# Altium schematic sheet ASB.SchDoc (part 2 of 3)
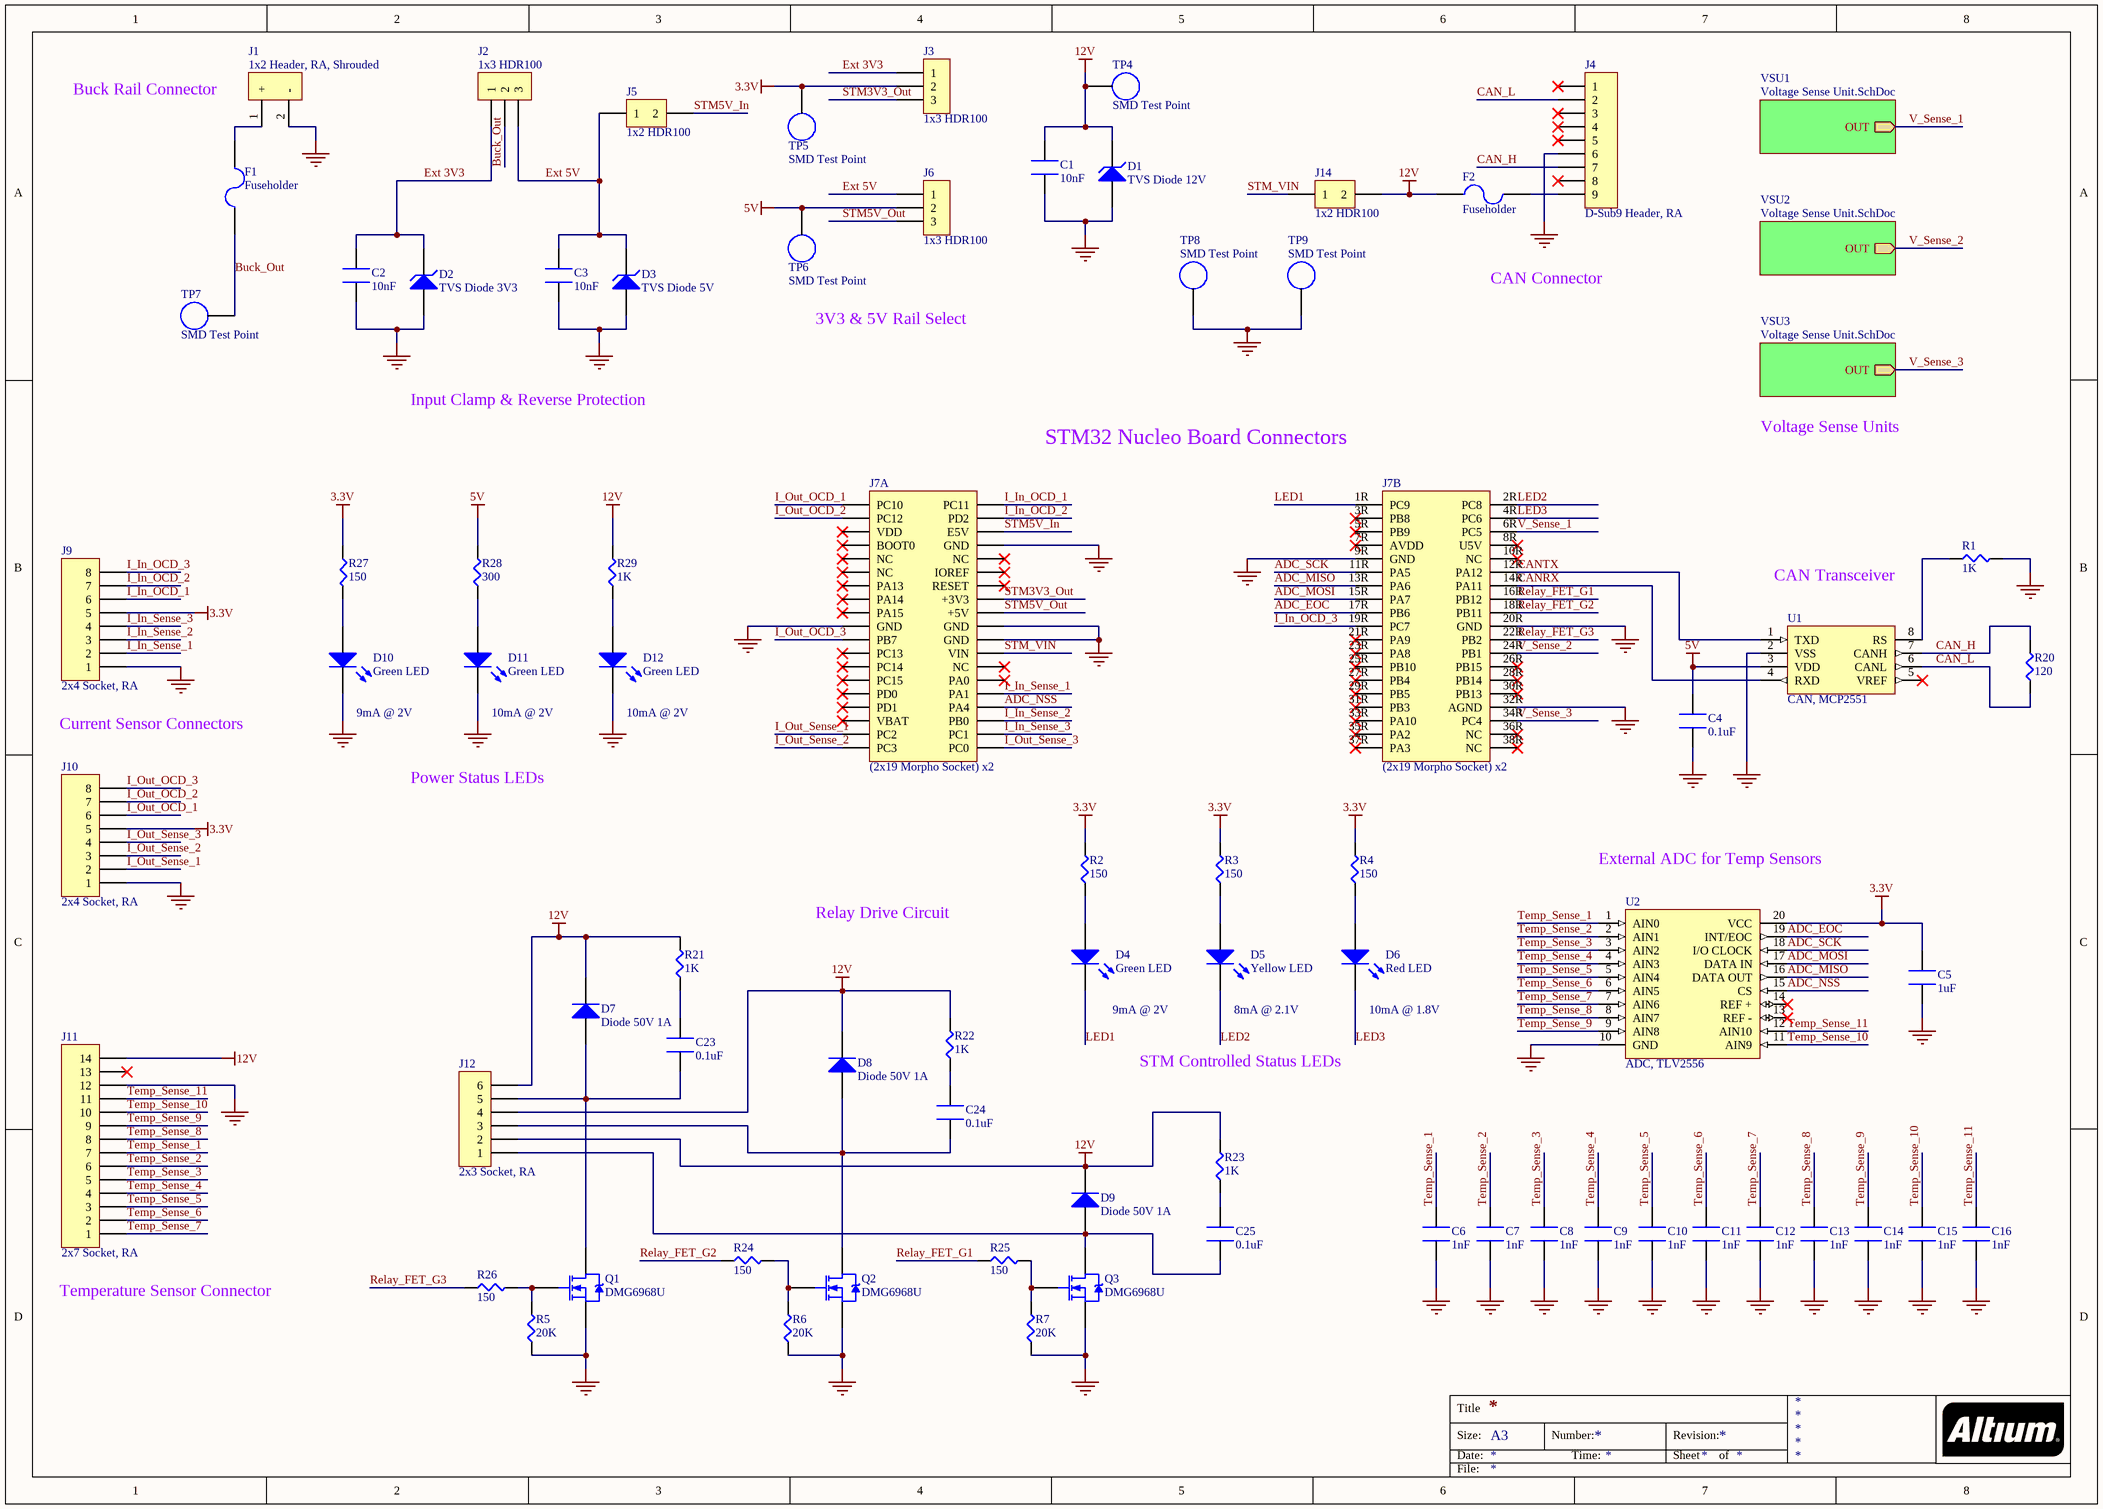
[diagram p1: ASB.SchDoc]
## Library data of the parts
C1-C3 = CL21B103KBANNNC: Cap Ceramic 0.01uF 50V X7R 10% SMD 0805 125C Paper T/R; Manufacturer: Samsung; Supplier 1: Digi-Key; Supplier Part Number 1: 1276-1015-1-ND; Manufacturer Part Number: CL21B103KBANNNC; Stock 1: 5594647; Pricing 1: 1 = 0.10000, 10 = 0.04100, 100 = 0.01830, 500 = 0.01310, 1000 = 0.01030 (USD); RoHS: Yes; Mount: Surface Mount; Case/Package: 0805; Case Code (Metric): 2012; Case Code (Imperial): 0805; Material: Ceramic; Contact Plating: Tin; Min Operating Temperature: -55°C; Max Operating Temperature: 125°C; Capacitance: 10nF; Tolerance: 10%; Packaging: Tape and Reel; Voltage Rating: 50V; Dielectric: X7R; Voltage: 50V; Voltage Rating (DC): 50V; Length: 2mm; Height: 0.65mm; Width: 0.049inch; Thickness: 0.03inch; Depth: 1.25mm; Radiation Hardening: No; Lead Free: Lead Free; ComponentLink1URL: https://datasheet.ciiva.com/25709/cl21b103kbannnc-25709781.pdf?src-supplier=Digi-Key; ComponentLink1Description: https://datasheet.ciiva.com/25709/cl21b103kbannnc-25709781.pdf?src-supplier=Digi-Key; ComponentLink2URL: https://datasheet.ciiva.com/26838/getdatasheetpartid-358359-26838647.pdf?src-supplier=Verical; ComponentLink2Description: https://datasheet.ciiva.com/26838/getdatasheetpartid-358359-26838647.pdf?src-supplier=Verical; ComponentLink3URL: https://datasheet.ciiva.com/29199/455082-da-01-en-vs-kondensator-0805-29199459.pdf?src-supplier=Conrad; ComponentLink3Description: https://datasheet.ciiva.com/29199/455082-da-01-en-vs-kondensator-0805-29199459.pdf?src-supplier=Conrad; ComponentLink4URL: https://datasheet.ciiva.com/16199/cl05b104kq5nnnc-16199304.pdf?src-supplier=Future+Electronics; ComponentLink4Description: https://datasheet.ciiva.com/16199/cl05b104kq5nnnc-16199304.pdf?src-supplier=Future+Electronics; ComponentLink5URL: https://datasheet.ciiva.com/26310/mlcc-catalogdownload2013-eng-26310223.pdf?src-supplier=Distrelec; ComponentLink5Description: https://datasheet.ciiva.com/26310/mlcc-catalogdownload2013-eng-26310223.pdf?src-supplier=Distrelec; Category: Capacitors
C4 C23-C25 = CL21B104KBCWPNC: CAP CER 0.1UF 50V X7R 0805; Manufacturer: Samsung; Capacitance: 100nF; Tolerance: 10%; Supplier 1: Digi-Key; Supplier Part Number 1: 1276-6557-1-ND; Manufacturer Part Number: CL21B104KBCWPNC; Stock 1: 6545; Pricing 1: 1 = 0.10000, 10 = 0.06700, 100 = 0.02990, 500 = 0.02138, 1000 = 0.01680 (USD); RoHS: Yes; Mount: Surface Mount; Case/Package: 0805; Case Code (Metric): 2012; Case Code (Imperial): 0805; Min Operating Temperature: -55°C; Max Operating Temperature: 125°C; Packaging: Tape and Reel; Voltage Rating: 50V; Features: Soft Termination; Length: 0.079inch; Width: 0.049inch; Thickness: 0.053inch; Ratings: AEC-Q200; Category: Capacitors
C5 = CL21B105KAFNNNE: Cap Ceramic 1uF 25V X7R 10% SMD 0805 125C T/R; Manufacturer: Samsung; Supplier 1: Digi-Key; Supplier Part Number 1: 1276-1066-1-ND; Manufacturer Part Number: CL21B105KAFNNNE; Stock 1: 1606570; Pricing 1: 1 = 0.10000, 10 = 0.07600, 100 = 0.03380, 500 = 0.02416, 1000 = 0.01898 (USD); RoHS: Yes; Mount: Surface Mount; Case/Package: 0805; Contact Plating: Tin; Case Code (Metric): 2012; Case Code (Imperial): 0805; Min Operating Temperature: -55°C; Max Operating Temperature: 125°C; Packaging: Tape and Reel; Package Quantity: 1; Capacitance: 1uF; Tolerance: 10%; Voltage Rating: 25V; Dielectric: X7R; Voltage: 25V; Voltage Rating (DC): 25V; Length: 2mm; Height: 1.25mm; Depth: 1.25mm; Width: 0.049inch; Thickness: 0.053inch; Radiation Hardening: No; Lead Free: Lead Free; ComponentLink1URL: https://datasheet.ciiva.com/25800/cl21b105kafnnne-25800163.pdf?src-supplier=Digi-Key; ComponentLink1Description: https://datasheet.ciiva.com/25800/cl21b105kafnnne-25800163.pdf?src-supplier=Digi-Key; ComponentLink2URL: https://datasheet.ciiva.com/15195/getdatasheetpartid-355205-15195880.pdf?src-supplier=Verical; ComponentLink2Description: https://datasheet.ciiva.com/15195/getdatasheetpartid-355205-15195880.pdf?src-supplier=Verical; Category: Capacitors
C6-C16 = C0805C102J5HACAUTO: CAP CER 0805 1NF 50V ULTRA STABL; Manufacturer: KEMET; Supplier 1: Digi-Key; Supplier Part Number 1: 399-16591-1-ND; Manufacturer Part Number: C0805C102J5HACAUTO; Stock 1: 1854; Pricing 1: 1 = 0.21000, 10 = 0.15100, 100 = 0.07080, 500 = 0.04964, 1000 = 0.04109 (USD); RoHS: No; ComponentLink1URL: https://api.kemet.com/component-edge/download/datasheet/C0805C102J5HACAUTO.pdf?src-supplier=Digi-Key; ComponentLink1Description: https://api.kemet.com/component-edge/download/datasheet/C0805C102J5HACAUTO.pdf?src-supplier=Digi-Key; Category: Capacitors
D1 = SD12T1G: TVS DIODE 12V 19V SOD323; Manufacturer: ON Semiconductor; Number of Elements: 1; Capacitance: 150pF; Reverse Breakdown Voltage: 13.3V; Max Surge Current: 15A; Direction: Unidirectional; Clamping Voltage: 25V; Peak Pulse Power: 350W; Power Line Protection: No; ESD Protection: Yes; Max Reverse Leakage Current: 1uA; Test Current: 1mA; Max Breakdown Voltage: 15.75V; Element Configuration: Single; Supplier 1: Digi-Key; Supplier Part Number 1: SD12T1GOSCT-ND; Manufacturer Part Number: SD12T1G; Stock 1: 159232; Pricing 1: 1 = 0.47000, 10 = 0.34900, 100 = 0.19740, 500 = 0.13076, 1000 = 0.10025 (USD); RoHS: Yes; Case/Package: SOD-323-2; Number of Pins: 2; Contact Plating: Tin; Min Operating Temperature: -55°C; Max Operating Temperature: 150°C; Package Quantity: 1; Operating Supply Voltage: 12V; Packaging: Tape and Reel; Number of Unidirectional Channels: 1; Reverse Standoff Voltage: 12V; Min Breakdown Voltage: 13.3V; Breakdown Voltage: 13.3V; Number of Channels: 1; Polarity: Unidirectional; Termination: SMD/SMT; Working Voltage: 12V; Leakage Current: 1uA; Peak Pulse Current: 15A; Power Dissipation: 350W; Voltage Rating (DC): 12V; Composition: Zener; Length: 1.7mm; Height: 1mm; Width: 1.35mm; Depth: 1.25mm; Radiation Hardening: No; Lead Free: Lead Free; ComponentLink1URL: https://datasheet.ciiva.com/11193/sd05t1-d-11193474.pdf?src-supplier=Avnet; ComponentLink1Description: https://datasheet.ciiva.com/11193/sd05t1-d-11193474.pdf?src-supplier=Avnet; ComponentLink2URL: https://datasheet.ciiva.com/15143/getdatasheetpartid-52921-15143109.pdf?src-supplier=Verical; ComponentLink2Description: https://datasheet.ciiva.com/15143/getdatasheetpartid-52921-15143109.pdf?src-supplier=Verical; ComponentLink3URL: https://datasheet.ciiva.com/30479/0900766b81250bd7-30479026.pdf?src-supplier=RSComponents; ComponentLink3Description: https://datasheet.ciiva.com/30479/0900766b81250bd7-30479026.pdf?src-supplier=RSComponents; ComponentLink4URL: https://datasheet.ciiva.com/339/sd05t1-d-339833.pdf?src-supplier=Digi-Key; ComponentLink4Description: https://datasheet.ciiva.com/339/sd05t1-d-339833.pdf?src-supplier=Digi-Key; ComponentLink5URL: https://datasheet.ciiva.com/11193/sd05t1-d-11193470.pdf?src-supplier=Avnet; ComponentLink5Description: https://datasheet.ciiva.com/11193/sd05t1-d-11193470.pdf?src-supplier=Avnet; ComponentLink6URL: https://datasheet.ciiva.com/339/sd05t1-d-339832.pdf?src-supplier=Digi-Key; ComponentLink6Description: https://datasheet.ciiva.com/339/sd05t1-d-339832.pdf?src-supplier=Digi-Key; ComponentLink7URL: https://datasheet.ciiva.com/339/sd05t1-d-339834.pdf?src-supplier=Digi-Key; ComponentLink7Description: https://datasheet.ciiva.com/339/sd05t1-d-339834.pdf?src-supplier=Digi-Key; Category: Circuit Protection
D2 = CDSOD323-T03S: ESD Suppressor TVS ±30kV 2-Pin SOD-323 T/R; Manufacturer: Bourns; Direction: Unidirectional; Operating Supply Voltage: 3.3V; Max Surge Current: 43A; Capacitance: 500pF; Number of Unidirectional Channels: 1; Min Breakdown Voltage: 4V; Clamping Voltage: 10.9V; Peak Pulse Power: 500W; Power Line Protection: No; Leakage Current: 125uA; Element Configuration: Single; Supplier 1: Digi-Key; Supplier Part Number 1: CDSOD323-T03SCT-ND; Manufacturer Part Number: CDSOD323-T03S; Stock 1: 99362; Pricing 1: 1 = 0.72000, 10 = 0.60600, 25 = 0.53000, 100 = 0.45420, 250 = 0.39368, 500 = 0.33310, 1000 = 0.25740 (USD); RoHS: Yes; Mount: Surface Mount; Case/Package: SOD-323-2; Number of Pins: 2; Contact Plating: Tin; Min Operating Temperature: -55°C; Max Operating Temperature: 150°C; Packaging: Tape and Reel; Package Quantity: 3000; Reverse Standoff Voltage: 3.3V; Polarity: Unidirectional; Number of Channels: 1; Breakdown Voltage: 4V; Termination: SMD/SMT; Working Voltage: 3.3V; Max Power Dissipation: 500W; Peak Pulse Current: 43A; Composition: Zener; Length: 1.9mm; Depth: 1.45mm; Radiation Hardening: No; REACH SVHC: No SVHC; ComponentLink1URL: https://datasheet.ciiva.com/22685/1671000-22685541.pdf?src-supplier=Element14; ComponentLink1Description: https://datasheet.ciiva.com/22685/1671000-22685541.pdf?src-supplier=Element14; ComponentLink2URL: https://datasheet.ciiva.com/6575/cdsod323-txxsc-6575941.pdf?src-supplier=Digi-Key; ComponentLink2Description: https://datasheet.ciiva.com/6575/cdsod323-txxsc-6575941.pdf?src-supplier=Digi-Key; ComponentLink3URL: https://datasheet.ciiva.com/11193/cdsod323-txxsc-11193742.pdf?src-supplier=Avnet; ComponentLink3Description: https://datasheet.ciiva.com/11193/cdsod323-txxsc-11193742.pdf?src-supplier=Avnet; Category: Circuit Protection
D3 = SD05T1G: TVS DIODE 5V 9.8V SOD323; Manufacturer: ON Semiconductor; Capacitance: 350pF; Direction: Unidirectional; Clamping Voltage: 14.5V; Peak Pulse Power: 350W; Number of Unidirectional Channels: 1; Min Breakdown Voltage: 6.2V; Power Line Protection: No; Peak Pulse Current: 24A; Element Configuration: Single; Breakdown Voltage: 6.75V; Leakage Current: 10uA; Max Breakdown Voltage: 7.3V; Test Current: 1mA; ESD Protection: Yes; Max Power Dissipation: 200mW; Supplier 1: Digi-Key; Supplier Part Number 1: SD05T1GOSCT-ND; Manufacturer Part Number: SD05T1G; Stock 1: 61559; Pricing 1: 1 = 0.49000, 10 = 0.36500, 100 = 0.20680, 500 = 0.13698, 1000 = 0.10502 (USD); RoHS: Yes; Case/Package: SOD-323-2; Number of Pins: 2; Contact Plating: Tin; Min Operating Temperature: -55°C; Max Operating Temperature: 150°C; Packaging: Tape and Reel; Reverse Standoff Voltage: 5V; Working Voltage: 5V; Composition: Zener; Package Quantity: 1; Operating Supply Voltage: 5V; Max Surge Current: 24A; Number of Elements: 1; Reverse Breakdown Voltage: 6.2V; Polarity: Unidirectional; Termination: SMD/SMT; Power Dissipation: 350W; Max Reverse Leakage Current: 10uA; Voltage Rating (DC): 5V; Max Output Current: 24A; Length: 1.7mm; Height: 1mm; Width: 1.35mm; Depth: 1.25mm; Radiation Hardening: No; Lead Free: Lead Free; REACH SVHC: No SVHC; ComponentLink1URL: https://datasheet.ciiva.com/4507/sd05t1-d-241634-4507873.pdf?src-supplier=Mouser; ComponentLink1Description: https://datasheet.ciiva.com/4507/sd05t1-d-241634-4507873.pdf?src-supplier=Mouser; ComponentLink2URL: https://datasheet.ciiva.com/16200/sd05t1-d-16200994.pdf?src-supplier=Future+Electronics; ComponentLink2Description: https://datasheet.ciiva.com/16200/sd05t1-d-16200994.pdf?src-supplier=Future+Electronics; ComponentLink3URL: https://datasheet.ciiva.com/15143/getdatasheetpartid-117154-15143559.pdf?src-supplier=Verical; ComponentLink3Description: https://datasheet.ciiva.com/15143/getdatasheetpartid-117154-15143559.pdf?src-supplier=Verical; ComponentLink4URL: https://datasheet.ciiva.com/30478/0900766b81250bd7-30478714.pdf?src-supplier=RSComponents; ComponentLink4Description: https://datasheet.ciiva.com/30478/0900766b81250bd7-30478714.pdf?src-supplier=RSComponents; ComponentLink5URL: https://datasheet.ciiva.com/339/sd05t1-d-339830.pdf?src-supplier=Digi-Key; ComponentLink5Description: https://datasheet.ciiva.com/339/sd05t1-d-339830.pdf?src-supplier=Digi-Key; ComponentLink6URL: https://datasheet.ciiva.com/339/sd05t1-d-339831.pdf?src-supplier=Digi-Key; ComponentLink6Description: https://datasheet.ciiva.com/339/sd05t1-d-339831.pdf?src-supplier=Digi-Key; ComponentLink7URL: https://datasheet.ciiva.com/11193/sd05t1-d-11193467.pdf?src-supplier=Avnet; ComponentLink7Description: https://datasheet.ciiva.com/11193/sd05t1-d-11193467.pdf?src-supplier=Avnet; ComponentLink8URL: https://datasheet.ciiva.com/22637/1878253-22637228.pdf?src-supplier=Element14; ComponentLink8Description: https://datasheet.ciiva.com/22637/1878253-22637228.pdf?src-supplier=Element14; ComponentLink9URL: https://datasheet.ciiva.com/25956/sd05t1-d-25956638.pdf?src-supplier=Avnet+Europe; ComponentLink9Description: https://datasheet.ciiva.com/25956/sd05t1-d-25956638.pdf?src-supplier=Avnet+Europe; Category: Circuit Protection
D4 D10-D12 = SML-LXT0805GW-TR: LED GREEN DIFFUSED SMD; Manufacturer: Lumex; Lens Color: White; Viewing Angle: 140°; Lens Style: Rectangular; Luminous Intensity: 11mcd; Forward Voltage: 2V; Wavelength: 565nm; Forward Current: 20mA; Power Rating: 50mW; Dominant Wavelength: 568nm; Number of LEDs: 1; Approvals: UL; Supplier 1: Digi-Key; Supplier Part Number 1: 67-1553-1-ND; Manufacturer Part Number: SML-LXT0805GW-TR; Stock 1: 417501; Pricing 1: 1 = 0.41000, 10 = 0.29000, 25 = 0.25160, 100 = 0.19360, 250 = 0.15732, 500 = 0.11616, 1000 = 0.09680 (USD); RoHS: Yes; Mount: Surface Mount; Case/Package: 0805; Number of Pins: 2; Color: Green; Case Code (Metric): 2012; Case Code (Imperial): 0805; Min Operating Temperature: -25°C; Max Operating Temperature: 85°C; Package Quantity: 1; Packaging: Tape and Reel; Illumination Color: Green; Test Current: 20mA; Lens Transparency: Diffused; Length: 2mm; Height: 0.8mm; Width: 1.25mm; REACH SVHC: No SVHC; Lead Free: Lead Free; ComponentLink1URL: https://datasheet.ciiva.com/2110/sml-lxt0805gw-tr-2110192.pdf?src-supplier=Digi-Key; ComponentLink1Description: https://datasheet.ciiva.com/2110/sml-lxt0805gw-tr-2110192.pdf?src-supplier=Digi-Key; ComponentLink2URL: https://datasheet.ciiva.com/4689/sml-lxt0805gw-tr-82662-4689266.pdf?src-supplier=Mouser; ComponentLink2Description: https://datasheet.ciiva.com/4689/sml-lxt0805gw-tr-82662-4689266.pdf?src-supplier=Mouser; ComponentLink3URL: https://datasheet.ciiva.com/30063/sml-lxt0805gw-tr-30063898.pdf?src-supplier=Onlinecomponents.com; ComponentLink3Description: https://datasheet.ciiva.com/30063/sml-lxt0805gw-tr-30063898.pdf?src-supplier=Onlinecomponents.com; ComponentLink4URL: https://datasheet.ciiva.com/2110/sml-lxt0805gw-tr-2110193.pdf?src-supplier=Digi-Key; ComponentLink4Description: https://datasheet.ciiva.com/2110/sml-lxt0805gw-tr-2110193.pdf?src-supplier=Digi-Key; ComponentLink5URL: https://datasheet.ciiva.com/2110/sml-lxt0805gw-tr-2110194.pdf?src-supplier=Digi-Key; ComponentLink5Description: https://datasheet.ciiva.com/2110/sml-lxt0805gw-tr-2110194.pdf?src-supplier=Digi-Key; ComponentLink6URL: https://datasheet.ciiva.com/16383/sml-lxt0805gw-tr-16383723.pdf?src-supplier=Future+Electronics; ComponentLink6Description: https://datasheet.ciiva.com/16383/sml-lxt0805gw-tr-16383723.pdf?src-supplier=Future+Electronics; Category: Optoelectronics
D5 = SML-LXT0805YW-TR: LED; Yellow; 10mcd; SMD; 100mA; 2.1V; 140deg; 585nm; Diffused; 5V; 50mW; -25degC; Manufacturer: Lumex; Lens Color: White; Viewing Angle: 140°; Lens Style: Rectangular; Forward Current: 20mA; Number of LEDs: 1; Approvals: UL; Supplier 1: Digi-Key; Supplier Part Number 1: 67-1554-1-ND; Manufacturer Part Number: SML-LXT0805YW-TR; Stock 1: 129042; Pricing 1: 1 = 0.38000, 10 = 0.27100, 25 = 0.23440, 100 = 0.18040, 250 = 0.14656, 500 = 0.10824, 1000 = 0.09020 (USD); RoHS: Yes; Mount: Surface Mount; Case/Package: 0805; Number of Pins: 2; Color: Yellow; Case Code (Metric): 2012; Case Code (Imperial): 0805; Min Operating Temperature: -25°C; Max Operating Temperature: 85°C; Wavelength: 585nm; Package Quantity: 1; Packaging: Tape and Reel; Luminous Intensity: 10mcd; Forward Voltage: 2.1V; Illumination Color: Yellow; Power Rating: 50mW; Test Current: 20mA; Lens Transparency: Diffused; Dominant Wavelength: 585nm; Length: 2mm; Height: 0.8mm; Width: 1.25mm; REACH SVHC: No SVHC; Lead Free: Lead Free; ComponentLink1URL: https://datasheet.ciiva.com/4689/sml-lxt0805yw-tr-114463-4689131.pdf?src-supplier=Mouser; ComponentLink1Description: https://datasheet.ciiva.com/4689/sml-lxt0805yw-tr-114463-4689131.pdf?src-supplier=Mouser; ComponentLink2URL: https://datasheet.ciiva.com/15967/sml-lxt0805yw-tr-15967416.pdf?src-supplier=Onlinecomponents.com; ComponentLink2Description: https://datasheet.ciiva.com/15967/sml-lxt0805yw-tr-15967416.pdf?src-supplier=Onlinecomponents.com; ComponentLink3URL: https://datasheet.ciiva.com/2110/sml-lxt0805yw-tr-2110162.pdf?src-supplier=Digi-Key; ComponentLink3Description: https://datasheet.ciiva.com/2110/sml-lxt0805yw-tr-2110162.pdf?src-supplier=Digi-Key; ComponentLink4URL: https://datasheet.ciiva.com/8072/sml-lxt0805yw-tr-8072917.pdf?src-supplier=Element14; ComponentLink4Description: https://datasheet.ciiva.com/8072/sml-lxt0805yw-tr-8072917.pdf?src-supplier=Element14; ComponentLink5URL: https://datasheet.ciiva.com/2110/sml-lxt0805yw-tr-2110163.pdf?src-supplier=Digi-Key; ComponentLink5Description: https://datasheet.ciiva.com/2110/sml-lxt0805yw-tr-2110163.pdf?src-supplier=Digi-Key; ComponentLink6URL: https://datasheet.ciiva.com/2110/sml-lxt0805yw-tr-2110164.pdf?src-supplier=Digi-Key; ComponentLink6Description: https://datasheet.ciiva.com/2110/sml-lxt0805yw-tr-2110164.pdf?src-supplier=Digi-Key; ComponentLink7URL: https://datasheet.ciiva.com/30084/sml-lxt0805yw-tr-30084235.pdf?src-supplier=Onlinecomponents.com; ComponentLink7Description: https://datasheet.ciiva.com/30084/sml-lxt0805yw-tr-30084235.pdf?src-supplier=Onlinecomponents.com; ComponentLink8URL: https://datasheet.ciiva.com/14603/70127240-14603821.pdf?src-supplier=Allied+Electronics; ComponentLink8Description: https://datasheet.ciiva.com/14603/70127240-14603821.pdf?src-supplier=Allied+Electronics; Category: Optoelectronics
D6 = SML-LXT0805SRW-TR: LED RED DIFFUSED 0805 SMD; Manufacturer: Lumex; Lens Color: White; Forward Current: 20mA; Forward Voltage: 1.8V; Power Rating: 80mW; Luminous Intensity: 21mcd; Viewing Angle: 140°; Wavelength: 660nm; Number of LEDs: 1; Supplier 1: Digi-Key; Supplier Part Number 1: 67-1555-1-ND; Manufacturer Part Number: SML-LXT0805SRW-TR; Stock 1: 60948; Pricing 1: 1 = 0.51000, 10 = 0.36600, 25 = 0.28080, 100 = 0.18320, 250 = 0.13432, 500 = 0.11396, 1000 = 0.09361 (USD); RoHS: Yes; Mount: Surface Mount; Case/Package: 0805; Number of Pins: 2; Color: Red; Case Code (Metric): 2012; Case Code (Imperial): 0805; Min Operating Temperature: -25°C; Max Operating Temperature: 80°C; Illumination Color: Red; Packaging: Tape and Reel; Lens Style: Diffused; Package Quantity: 1; Test Current: 20mA; Lens Transparency: Diffused; Length: 2mm; Height: 0.8mm; Width: 1.25mm; REACH SVHC: No SVHC; Lead Free: Lead Free; ComponentLink1URL: https://datasheet.ciiva.com/15967/smllxt0805srwtr-15967412.pdf?src-supplier=Onlinecomponents.com; ComponentLink1Description: https://datasheet.ciiva.com/15967/smllxt0805srwtr-15967412.pdf?src-supplier=Onlinecomponents.com; ComponentLink2URL: https://datasheet.ciiva.com/4688/sml-lxt0805srw-tr-114457-4688733.pdf?src-supplier=Mouser; ComponentLink2Description: https://datasheet.ciiva.com/4688/sml-lxt0805srw-tr-114457-4688733.pdf?src-supplier=Mouser; ComponentLink3URL: https://datasheet.ciiva.com/2110/sml-lxt0805srw-tr-2110039.pdf?src-supplier=Digi-Key; ComponentLink3Description: https://datasheet.ciiva.com/2110/sml-lxt0805srw-tr-2110039.pdf?src-supplier=Digi-Key; ComponentLink4URL: https://datasheet.ciiva.com/2110/sml-lxt0805srw-tr-2110040.pdf?src-supplier=Digi-Key; ComponentLink4Description: https://datasheet.ciiva.com/2110/sml-lxt0805srw-tr-2110040.pdf?src-supplier=Digi-Key; ComponentLink5URL: https://datasheet.ciiva.com/2110/sml-lxt0805srw-tr-2110041.pdf?src-supplier=Digi-Key; ComponentLink5Description: https://datasheet.ciiva.com/2110/sml-lxt0805srw-tr-2110041.pdf?src-supplier=Digi-Key; ComponentLink6URL: https://datasheet.ciiva.com/16376/sml-lxt0805srw-tr-16376845.pdf?src-supplier=Future+Electronics; ComponentLink6Description: https://datasheet.ciiva.com/16376/sml-lxt0805srw-tr-16376845.pdf?src-supplier=Future+Electronics; Category: Optoelectronics
D7-D9 = CGRKM4001-HF: DIODE GEN PURP 50V 1A SOD123F; Manufacturer: Comchip; Supplier 1: Digi-Key; Supplier Part Number 1: 641-1511-1-ND; Manufacturer Part Number: CGRKM4001-HF; Stock 1: 8991; Pricing 1: 1 = 0.35000, 10 = 0.32200, 100 = 0.18030, 500 = 0.09656, 1000 = 0.06566 (USD); RoHS: Yes; Mount: Surface Mount; Package Quantity: 2500; Packaging: Tape and Reel; Average Rectified Current: 1A; Max Reverse Voltage (DC): 50V; ComponentLink1URL: http://www.mouser.com/ds/2/80/CGRKM4001-HF%20Thru.%20CGRKM4007-HF%20RevG-531933.pdf?src-supplier=Mouser; ComponentLink1Description: http://www.mouser.com/ds/2/80/CGRKM4001-HF%20Thru.%20CGRKM4007-HF%20RevG-531933.pdf?src-supplier=Mouser; ComponentLink2URL: http://www.comchiptech.com/admin/files/product/CGRKM4001-HF Thru. CGRKM4007-HF RevG.pdf?src-supplier=Digi-Key; ComponentLink2Description: http://www.comchiptech.com/admin/files/product/CGRKM4001-HF Thru. CGRKM4007-HF RevG.pdf?src-supplier=Digi-Key; Category: Discrete Semiconductor Products
F1 F2 = 0031.7701.11: SCHURTER - 0031.7701.11 - FUSE HOLDER, PCB MOUNT; Color: White; Material: Tin; Body Material: Thermoplastic; Current Rating: 5A; Voltage Rating (AC): 125V; Number of Poles: 1; Illumination Type: Illuminated; Supplier 1: Digi-Key; Supplier Part Number 1: 486-1991-ND; Manufacturer: Schurter; Manufacturer Part Number: 0031.7701.11; Stock 1: 11381; Pricing 1: 1 = 1.39000, 50 = 1.03400, 100 = 0.93100, 500 = 0.70300, 1000 = 0.52080 (USD); RoHS: Yes; Mount: Surface Mount; Weight: 0.016932oz; Contact Material: Copper Alloy; Contact Plating: Tin; Terminal Material: Brass; Min Operating Temperature: -40°C; Max Operating Temperature: 85°C; Package Quantity: 100; Packaging: Bulk; Voltage Rating: 125V; Number of Circuits: 1; Termination: SMD/SMT; Voltage: 125V; Fuse Current: 5A; Voltage Rating (DC): 125V; Length: 12mm; Height: 6mm; Width: 5.2mm; Depth: 5.2mm; Radiation Hardening: No; REACH SVHC: No SVHC; Lead Free: Lead Free; ComponentLink1URL: https://datasheet.ciiva.com/1270/typ-omh-125-1270896.pdf?src-supplier=Element14; ComponentLink1Description: https://datasheet.ciiva.com/1270/typ-omh-125-1270896.pdf?src-supplier=Element14; ComponentLink2URL: https://datasheet.ciiva.com/7496/typ-omh-125-7496724.pdf?src-supplier=Digi-Key; ComponentLink2Description: https://datasheet.ciiva.com/7496/typ-omh-125-7496724.pdf?src-supplier=Digi-Key; ComponentLink3URL: https://datasheet.ciiva.com/16215/typ-omh-125-16215096.pdf?src-supplier=Onlinecomponents.com; ComponentLink3Description: https://datasheet.ciiva.com/16215/typ-omh-125-16215096.pdf?src-supplier=Onlinecomponents.com; ComponentLink4URL: https://datasheet.ciiva.com/30058/73typ-omh-125-30058618.pdf?src-supplier=Onlinecomponents.com; ComponentLink4Description: https://datasheet.ciiva.com/30058/73typ-omh-125-30058618.pdf?src-supplier=Onlinecomponents.com; ComponentLink5URL: https://datasheet.ciiva.com/14128/awomh125-data-e-14128364.pdf?src-supplier=Distrelec; ComponentLink5Description: https://datasheet.ciiva.com/14128/awomh125-data-e-14128364.pdf?src-supplier=Distrelec; ComponentLink6URL: https://datasheet.ciiva.com/1221/1925349-1221826.pdf?src-supplier=Newark; ComponentLink6Description: https://datasheet.ciiva.com/1221/1925349-1221826.pdf?src-supplier=Newark; ComponentLink7URL: https://datasheet.ciiva.com/3014/typ-omh-125-3014522.pdf?src-supplier=Avnet; ComponentLink7Description: https://datasheet.ciiva.com/3014/typ-omh-125-3014522.pdf?src-supplier=Avnet; ComponentLink8URL: https://datasheet.ciiva.com/4480/typ-omh-125-4480427.pdf?src-supplier=Mouser; ComponentLink8Description: https://datasheet.ciiva.com/4480/typ-omh-125-4480427.pdf?src-supplier=Mouser; ComponentLink9URL: https://datasheet.ciiva.com/17405/typ-omh-125-17405484.pdf?src-supplier=Avnet+Europe; ComponentLink9Description: https://datasheet.ciiva.com/17405/typ-omh-125-17405484.pdf?src-supplier=Avnet+Europe; Category: Circuit Protection; ComponentLink10Description: Digikey; ComponentLink10URL: https://www.digikey.ca/product-detail/en/schurter-inc/0031.7701.11/486-1991-ND/640027
J1 = 70553-0001: Headers & Wire Housings R/A HDR 2P low profile single; Manufacturer: Molex; Number of Positions: 2; Gender: Male; Contact Resistance: 30mR; Current Rating: 3A; Voltage Rating: 250V; Insulation Resistance: 1GR; Pitch: 2.54mm; Approvals: UL; Glow Wire Compliant: Non-compliant; Supplier 1: Digi-Key; Supplier Part Number 1: WM4900-ND; Manufacturer Part Number: 70553-0001; Stock 1: 15280; Pricing 1: 1 = 0.71000, 72 = 0.53486, 144 = 0.51264, 504 = 0.44575, 1008 = 0.36775, 5040 = 0.32318, 10008 = 0.30089 (USD); RoHS: Yes; Mount: Through Hole; Color: Black; Housing Color: Black; Housing Material: Thermoplastic; Contact Material: Bronze; Contact Plating: Gold; Material: Brass; Min Operating Temperature: -40°C; Max Operating Temperature: 105°C; Number of Rows: 1; Packaging: Rail/Tube; Termination: Through Hole; Number of Contacts: 2; Orientation: Right Angle; Package Quantity: 2880; Number of Circuits: 2; Voltage Rating (DC): 250V; Radiation Hardening: No; Lead Free: Lead Free; REACH SVHC: Unknown; ELV: Compliant; Flammability Rating: UL94 V-0; ComponentLink1URL: https://datasheet.ciiva.com/5158/0705530001-pcb-headers-172944-5158768.pdf?src-supplier=Mouser; ComponentLink1Description: https://datasheet.ciiva.com/5158/0705530001-pcb-headers-172944-5158768.pdf?src-supplier=Mouser; ComponentLink2URL: https://datasheet.ciiva.com/11746/0900766b80d8d649-11746625.pdf?src-supplier=RSComponents; ComponentLink2Description: https://datasheet.ciiva.com/11746/0900766b80d8d649-11746625.pdf?src-supplier=RSComponents; ComponentLink3URL: https://datasheet.ciiva.com/16657/0705530001-pcb-headers-16657777.pdf?src-supplier=Avnet+Europe; ComponentLink3Description: https://datasheet.ciiva.com/16657/0705530001-pcb-headers-16657777.pdf?src-supplier=Avnet+Europe; ComponentLink4URL: https://datasheet.ciiva.com/7920/ps-70541-7920854.pdf?src-supplier=Element14; ComponentLink4Description: https://datasheet.ciiva.com/7920/ps-70541-7920854.pdf?src-supplier=Element14; ComponentLink5URL: https://datasheet.ciiva.com/30195/179180705530001-pcb-headers-30195548.pdf?src-supplier=Onlinecomponents.com; ComponentLink5Description: https://datasheet.ciiva.com/30195/179180705530001-pcb-headers-30195548.pdf?src-supplier=Onlinecomponents.com; ComponentLink6URL: https://datasheet.ciiva.com/1438/1887076-1438989.pdf?src-supplier=Element14; ComponentLink6Description: https://datasheet.ciiva.com/1438/1887076-1438989.pdf?src-supplier=Element14; ComponentLink7URL: https://datasheet.ciiva.com/10090/0705530001-pcb-headers-10090317.pdf?src-supplier=Avnet; ComponentLink7Description: https://datasheet.ciiva.com/10090/0705530001-pcb-headers-10090317.pdf?src-supplier=Avnet; Category: Connectors; ComponentLink8Description: Digikey; ComponentLink8URL: https://www.digikey.com/product-detail/en/molex/0705530001/WM4900-ND/114951
J2 J3 J6 = 0901200763: CONN HEADER VERT 3POS 2.54MM; Manufacturer: Molex; Manufacturer Part Number: 90120-0763; Number of Positions: 3; Gender: Male; Contact Resistance: 20mR; Max Voltage Rating (DC): 350.35kV; Current Rating: 3A; Voltage Rating (AC): 350V; Insulation Resistance: 5GR; Number of Circuits: 2; Glow Wire Compliant: Non-compliant; Supplier 1: Digi-Key; Supplier Part Number 1: WM8085-ND; Stock 1: 17038; Pricing 1: 1 = 0.90000, 10 = 0.79100, 100 = 0.68200, 500 = 0.55800, 1000 = 0.49600, 5000 = 0.43400, 10000 = 0.41230 (USD); RoHS: Yes; Mount: Through Hole; Color: Black; Housing Color: Black; Housing Material: Polyester; Contact Plating: Tin; Contact Material: Brass; Material: Glass; Min Operating Temperature: -55°C; Max Operating Temperature: 125°C; Number of Rows: 1; Packaging: Tray; Termination: Solder; Orientation: Straight; Number of Contacts: 3; Package Quantity: 3000; Number of Poles: 3; Voltage Rating: 350V; Working Voltage: 350V; Voltage Rating (DC): 350V; Pitch: 2.54mm; Lead Pitch: 2.54mm; Radiation Hardening: No; REACH SVHC: Unknown; Lead Free: Lead Free; Flammability Rating: UL94 V-2; Halogen Free: Not Halogen Free; ComponentLink1URL: https://datasheet.ciiva.com/30177/19330901200763-pcb-headers-30177538.pdf?src-supplier=Onlinecomponents.com; ComponentLink1Description: https://datasheet.ciiva.com/30177/19330901200763-pcb-headers-30177538.pdf?src-supplier=Onlinecomponents.com; ComponentLink2URL: https://datasheet.ciiva.com/11747/0900766b8002f268-11747896.pdf?src-supplier=RSComponents; ComponentLink2Description: https://datasheet.ciiva.com/11747/0900766b8002f268-11747896.pdf?src-supplier=RSComponents; ComponentLink3URL: https://datasheet.ciiva.com/5150/0901200763-pcb-headers-230143-5150559.pdf?src-supplier=Mouser; ComponentLink3Description: https://datasheet.ciiva.com/5150/0901200763-pcb-headers-230143-5150559.pdf?src-supplier=Mouser; Category: Connectors
J4 = 5747840-6: CONN D-SUB PLUG 9POS R/A SOLDER; Manufacturer: TE Connectivity; Body Material: Metal; Body Plating: Tin; Voltage Rating: 125V; Current Rating: 6A; Gender: Male; Number of Positions: 9; Number of Ports: 1; Mating Connector Lock: Yes (With); PCB Mount Retention: With; PCB Mounting Orientation: Right Angle; Preloaded: Yes; Sealable: No (Without); Pitch: 2.74mm; PCB Thickness: 1.57mm; Contact Post Length: 3.17mm; Hole Diameter: 0.125inch; Approvals: CSA,UL; Supplier 1: Digi-Key; Supplier Part Number 1: A32094-ND; Manufacturer Part Number: 5747840-6; Stock 1: 2830; Pricing 1: 1 = 4.13000, 10 = 3.96400, 25 = 3.63360, 50 = 3.46860, 130 = 3.30338, 260 = 2.89046, 520 = 2.80788, 1040 = 2.39496, 2600 = 2.22980 (USD); RoHS: Yes; Mount: Through Hole; Case/Package: Metal; Contact Material: Brass; Contact Plating: Gold,Nickel,Tin; Color: Black; Number of Terminals: 9; Material: Metal; Plating: Tin; Housing Material: Nylon; Contact Shape: Round; Housing Color: Black; Shell Material: Steel; Min Operating Temperature: -55°C; Max Operating Temperature: 105°C; Number of Rows: 2; Packaging: Tray; Package Quantity: 130; Connector Type: Plug; Termination: Solder; Number of Contacts: 9; Orientation: Right Angle; Mating Retention: Yes (With); PCB Mount Alignment: Yes (With); Length: 30.81mm; Height: 12.55mm; Width: 12.55mm; Depth: 18.62mm; Radiation Hardening: No; REACH SVHC: No SVHC; Flammability Rating: UL94 V-0; ComponentLink1URL: https://www.verical.com/server-webapp/html/getDatasheet?partID=46840&src-supplier=Verical; ComponentLink1Description: https://www.verical.com/server-webapp/html/getDatasheet?partID=46840&src-supplier=Verical; ComponentLink2URL: https://www.te.com/commerce/DocumentDelivery/DDEController?Action=srchrtrv&DocNm=82068_AMPLIMITE_Right-Angle_Posted_Conn&DocType=CS&DocLang=English&src-supplier=Digi-Key; ComponentLink2Description: https://www.te.com/commerce/DocumentDelivery/DDEController?Action=srchrtrv&DocNm=82068_AMPLIMITE_Right-Angle_Posted_Conn&DocType=CS&DocLang=English&src-supplier=Digi-Key; ComponentLink3URL: http://www.jameco.com/Jameco/Products/ProdDS/853231.pdf?src-supplier=Jameco; ComponentLink3Description: http://www.jameco.com/Jameco/Products/ProdDS/853231.pdf?src-supplier=Jameco; ComponentLink4URL: http://www.te.com/commerce/DocumentDelivery/DDEController?Action=srchrtrv&DocNm=82068_AMPLIMITE_Right-Angle_Posted_Conn&DocType=Catalog+Section&DocLang=English&src-supplier=Avnet+Europe; ComponentLink4Description: http://www.te.com/commerce/DocumentDelivery/DDEController?Action=srchrtrv&DocNm=82068_AMPLIMITE_Right-Angle_Posted_Conn&DocType=Catalog+Section&DocLang=English&src-supplier=Avnet+Europe; ComponentLink5URL: http://www.te.com/commerce/DocumentDelivery/DDEController?Action=srchrtrv&DocNm=82068_AMPLIMITE_Right-Angle_Posted_Conn&DocType=Catalog+Section&DocLang=English&src-supplier=Avnet; ComponentLink5Description: http://www.te.com/commerce/DocumentDelivery/DDEController?Action=srchrtrv&DocNm=82068_AMPLIMITE_Right-Angle_Posted_Conn&DocType=Catalog+Section&DocLang=English&src-supplier=Avnet; ComponentLink6URL: http://www.te.com/commerce/DocumentDelivery/DDEController?Action=srchrtrv&DocNm=82068_AMPLIMITE_Right-Angle_Posted_Conn&DocType=Catalog+Section&DocLang=English&PartCntxt=&src-supplier=Element14; ComponentLink6Description: http://www.te.com/commerce/DocumentDelivery/DDEController?Action=srchrtrv&DocNm=82068_AMPLIMITE_Right-Angle_Posted_Conn&DocType=Catalog+Section&DocLang=English&PartCntxt=&src-supplier=Element14; Category: Connectors
J5 J14 = 0901200762: CONN HEADER VERT 2POS 2.54MM; Manufacturer: Molex; Number of Positions: 2; Connector Type: Male Pin; Contact Resistance: 20mR; Max Voltage Rating (DC): 350V; Gender: Male; Supplier 1: Digi-Key; Supplier Part Number 1: WM8084-ND; Manufacturer Part Number: 0901200762; Stock 1: 37733; Pricing 1: 1 = 0.560000, 10 = 0.530000, 100 = 0.406000, 500 = 0.353000, 1000 = 0.291230, 5000 = 0.255930, 10000 = 0.238280 (USD); RoHS: Yes; Mount: Through Hole; Color: Black; Housing Color: Black; Housing Material: Polyester; Contact Plating: Gold; Contact Material: Brass; Min Operating Temperature: -55°C; Max Operating Temperature: 125°C; Packaging: Bulk; Number of Rows: 1; Termination: Solder; Number of Contacts: 2; Orientation: Straight; Max Voltage Rating (AC): 350V; Length: 5.08mm; Pitch: 2.54mm; Depth: 2.54mm; Contact Mating Length: 0.266inch; ComponentLink1URL: https://datasheet.ciiva.com/711/901200762-sd-711939.pdf?src-supplier=Digi-Key; ComponentLink1Description: https://datasheet.ciiva.com/711/901200762-sd-711939.pdf?src-supplier=Digi-Key; ComponentLink2URL: https://datasheet.ciiva.com/3117/0901200762-pcb-headers-3117809.pdf?src-supplier=Avnet; ComponentLink2Description: https://datasheet.ciiva.com/3117/0901200762-pcb-headers-3117809.pdf?src-supplier=Avnet; Category: Connectors
J7 = STM32 Nucleo Connector: SAMTEC         ESQ-119-24-T-D             Board-To-Board Connector, Vertical, ESQ Series, 38 Contacts, Receptacle, 2.54 mm, Through Hole 123; Number of Contacts: 38; Pitch: 2.54mm; Supplier 1: Digi-Key; Supplier Part Number 1: SAM9313-ND; Manufacturer: Samtec; Manufacturer Part Number: ESQ-119-24-T-D; Stock 1: 71; Pricing 1: 1 = 5.23000, 11 = 4.42182, 110 = 3.41700, 506 = 2.81399, 1001 = 2.61300 (USD); RoHS: Yes; Mount: Through Hole; Contact Plating: Tin; Contact Material: Bronze; Number of Rows: 2; Gender: Receptacle; Termination: Solder; REACH SVHC: No SVHC; Category: Connectors
J9 J10 = 1053141208: CONN HEADER R/A 8POS 2.5MM; Manufacturer: Molex; Gender: Male; Supplier 1: Digi-Key; Supplier Part Number 1: WM14978-ND; Manufacturer Part Number: 1053141208; Stock 1: 3073; Pricing 1: 1 = 2.35000, 10 = 2.13500, 156 = 1.82994, 624 = 1.52495, 1092 = 1.30710, 5148 = 1.15896 (USD); RoHS: No; Mount: Through Hole; Contact Plating: Gold; Contact Material: Brass; Color: Black; Termination: Through Hole; Number of Rows: 2; REACH SVHC: Unknown; ComponentLink1URL: https://www.molex.com/pdm_docs/ps/PS-105300-100-001.pdf?src-supplier=Digi-Key; ComponentLink1Description: https://www.molex.com/pdm_docs/ps/PS-105300-100-001.pdf?src-supplier=Digi-Key; ComponentLink2URL: http://www.farnell.com/datasheets/2059602.pdf?src-supplier=Element14; ComponentLink2Description: http://www.farnell.com/datasheets/2059602.pdf?src-supplier=Element14; Category: Connectors
J11 = 1053141214: CONN HEADER R/A 14POS 2.5MM; Manufacturer: Molex; Supplier 1: Digi-Key; Supplier Part Number 1: WM15164-ND; Manufacturer Part Number: 1053141214; Stock 1: 970; Pricing 1: 1 = 3.04000, 90 = 2.55378, 180 = 2.43222, 540 = 2.06737, 1080 = 1.76334, 5040 = 1.58093 (USD); RoHS: No; ComponentLink1URL: https://www.molex.com/pdm_docs/ps/PS-105300-100-001.pdf?src-supplier=Digi-Key; ComponentLink1Description: https://www.molex.com/pdm_docs/ps/PS-105300-100-001.pdf?src-supplier=Digi-Key; Category: Connectors
J12 = 1053141206: CONN HEADER R/A 6POS 2.5MM; Manufacturer: Molex; Gender: Male; Supplier 1: Digi-Key; Supplier Part Number 1: WM14977-ND; Manufacturer Part Number: 1053141206; Stock 1: 3725; Pricing 1: 1 = 1.86000, 10 = 1.68400, 204 = 1.44314, 612 = 1.20260, 1020 = 1.03080, 5100 = 0.91398, 10200 = 0.89336 (USD); RoHS: No; Mount: Through Hole; Contact Plating: Gold; Contact Material: Brass; Color: Black; Termination: Through Hole; Number of Rows: 2; REACH SVHC: Unknown; ComponentLink1URL: http://www.farnell.com/datasheets/2221464.pdf?src-supplier=Farnell; ComponentLink1Description: http://www.farnell.com/datasheets/2221464.pdf?src-supplier=Farnell; ComponentLink2URL: http://www.farnell.com/datasheets/2059602.pdf?src-supplier=Element14; ComponentLink2Description: http://www.farnell.com/datasheets/2059602.pdf?src-supplier=Element14; ComponentLink3URL: https://www.molex.com/pdm_docs/ps/PS-105300-100-001.pdf?src-supplier=Digi-Key; ComponentLink3Description: https://www.molex.com/pdm_docs/ps/PS-105300-100-001.pdf?src-supplier=Digi-Key; Category: Connectors
Q1-Q3 = DMG6968U-7: MOSFET N-CH 20V 6.5A SOT-23; Manufacturer: Diodes; Nominal Vgs: 500mV; Input Capacitance: 151pF; Max Power Dissipation: 1.3W; Number of Elements: 1; Rise Time: 66ns; Rds On Max: 25mR; Turn-Off Delay Time: 613ns; Turn-On Delay Time: 54ns; Fall Time: 205ns; Element Configuration: Single; Gate to Source Voltage (Vgs): 12V; On-State Resistance: 36mR; Supplier 1: Digi-Key; Supplier Part Number 1: DMG6968UDICT-ND; Manufacturer Part Number: DMG6968U-7; Stock 1: 169109; Pricing 1: 1 = 0.59000, 10 = 0.41800, 100 = 0.27420, 500 = 0.16202, 1000 = 0.12463 (USD); RoHS: Yes; Mount: Surface Mount; Case/Package: SOT-23; Number of Pins: 3; Weight: 0.000282oz; Min Operating Temperature: -55°C; Max Operating Temperature: 150°C; Packaging: Tape and Reel; Package Quantity: 3000; Drain to Source Voltage (Vdss): 20V; Continuous Drain Current (ID): 6.5A; Drain to Source Breakdown Voltage: 20V; Drain to Source Resistance: 25mR; Power Dissipation: 1.3W; Threshold Voltage: 500mV; Number of Channels: 1; Length: 2.9mm; Height: 1mm; Width: 1.3mm; Radiation Hardening: No; REACH SVHC: No SVHC; Lead Free: Lead Free; ComponentLink1URL: https://datasheet.ciiva.com/5774/ds31738-5774992.pdf?src-supplier=Farnell; ComponentLink1Description: https://datasheet.ciiva.com/5774/ds31738-5774992.pdf?src-supplier=Farnell; ComponentLink2URL: https://datasheet.ciiva.com/26789/dmg6968u-7-26789941.pdf?src-supplier=IIIC; ComponentLink2Description: https://datasheet.ciiva.com/26789/dmg6968u-7-26789941.pdf?src-supplier=IIIC; ComponentLink3URL: https://datasheet.ciiva.com/935/ds31738-935016.pdf?src-supplier=Digi-Key; ComponentLink3Description: https://datasheet.ciiva.com/935/ds31738-935016.pdf?src-supplier=Digi-Key; ComponentLink4URL: https://datasheet.ciiva.com/935/ds31738-935018.pdf?src-supplier=Digi-Key; ComponentLink4Description: https://datasheet.ciiva.com/935/ds31738-935018.pdf?src-supplier=Digi-Key; ComponentLink5URL: https://datasheet.ciiva.com/935/ds31738-935017.pdf?src-supplier=Digi-Key; ComponentLink5Description: https://datasheet.ciiva.com/935/ds31738-935017.pdf?src-supplier=Digi-Key; ComponentLink6URL: https://datasheet.ciiva.com/22712/1915638-22712395.pdf?src-supplier=Element14; ComponentLink6Description: https://datasheet.ciiva.com/22712/1915638-22712395.pdf?src-supplier=Element14; Category: Discrete Semiconductor Products
R1 R21-R23 R29 = ERJ6ENF1001V: RES SMD 1K OHM 1% 1/8W 0805; Manufacturer: Panasonic; Resistance: 1kR; Power Rating: 125mW; Temperature Coefficient: 100ppm/°C; Voltage Rating (DC): 150V; Supplier 1: Digi-Key; Supplier Part Number 1: P1.00KCCT-ND; Manufacturer Part Number: ERJ6ENF1001V; Stock 1: 946321; Pricing 1: 1 = 0.100000, 10 = 0.081000, 100 = 0.031100, 1000 = 0.013670, 2500 = 0.011810 (USD); RoHS: Yes; Mount: Surface Mount; Case/Package: 0805; Number of Pins: 2; Case Code (Metric): 2012; Case Code (Imperial): 0805; Contact Plating: Tin; Min Operating Temperature: -55°C; Max Operating Temperature: 155°C; Tolerance: 1%; Packaging: Tape and Reel; Number of Terminations: 2; Package Quantity: 1; Voltage Rating: 150V; Composition: Thick Film; Termination: SMD/SMT; Military Standard: Not; Max Power Dissipation: 125mW; Features: Automotive AEC-Q200; Length: 2mm; Height: 0.6mm; Width: 0.049inch; Depth: 1.25mm; Radiation Hardening: No; REACH SVHC: No SVHC; Lead Free: Lead Free; ComponentLink1URL: https://datasheet.ciiva.com/34303/1988962-34303619.pdf?src-supplier=Jameco; ComponentLink1Description: https://datasheet.ciiva.com/34303/1988962-34303619.pdf?src-supplier=Jameco; ComponentLink2URL: https://datasheet.ciiva.com/11808/0900766b80f80784-11808500.pdf?src-supplier=RSComponents; ComponentLink2Description: https://datasheet.ciiva.com/11808/0900766b80f80784-11808500.pdf?src-supplier=RSComponents; ComponentLink3URL: https://datasheet.ciiva.com/28532/426256-28532134.pdf?src-supplier=Element14; ComponentLink3Description: https://datasheet.ciiva.com/28532/426256-28532134.pdf?src-supplier=Element14; ComponentLink4URL: https://datasheet.ciiva.com/30051/aoa0000ce2-30051974.pdf?src-supplier=Onlinecomponents.com; ComponentLink4Description: https://datasheet.ciiva.com/30051/aoa0000ce2-30051974.pdf?src-supplier=Onlinecomponents.com; ComponentLink5URL: https://datasheet.ciiva.com/16774/70260748-16774249.pdf?src-supplier=Allied+Electronics; ComponentLink5Description: https://datasheet.ciiva.com/16774/70260748-16774249.pdf?src-supplier=Allied+Electronics; ComponentLink6URL: https://datasheet.ciiva.com/46373/1678782-46373337.pdf?src-supplier=Element14; ComponentLink6Description: https://datasheet.ciiva.com/46373/1678782-46373337.pdf?src-supplier=Element14; ComponentLink7URL: https://datasheet.ciiva.com/46373/1678782-46373338.pdf?src-supplier=Element14; ComponentLink7Description: https://datasheet.ciiva.com/46373/1678782-46373338.pdf?src-supplier=Element14; ComponentLink8URL: https://datasheet.ciiva.com/48532/aoa0000ce2-48532156.pdf?src-supplier=Avnet; ComponentLink8Description: https://datasheet.ciiva.com/48532/aoa0000ce2-48532156.pdf?src-supplier=Avnet; ComponentLink9URL: https://datasheet.ciiva.com/7942/426256-7942429.pdf?src-supplier=Element14; ComponentLink9Description: https://datasheet.ciiva.com/7942/426256-7942429.pdf?src-supplier=Element14; ComponentLink10URL: https://datasheet.ciiva.com/16199/aoa0000ce2-16199262.pdf?src-supplier=Future+Electronics; ComponentLink10Description: https://datasheet.ciiva.com/16199/aoa0000ce2-16199262.pdf?src-supplier=Future+Electronics; ComponentLink11URL: https://datasheet.ciiva.com/9117/aoa0000ce2-9117391.pdf?src-supplier=Avnet; ComponentLink11Description: https://datasheet.ciiva.com/9117/aoa0000ce2-9117391.pdf?src-supplier=Avnet; ComponentLink12URL: https://datasheet.ciiva.com/16523/aoa0000ce2-16523855.pdf?src-supplier=Avnet+Asia; ComponentLink12Description: https://datasheet.ciiva.com/16523/aoa0000ce2-16523855.pdf?src-supplier=Avnet+Asia; Category: Resistors
R2-R4 R24-R27 = ERJ6ENF1500V: RES SMD 150 OHM 1% 1/8W 0805; Manufacturer: Panasonic; Voltage Rating: 150V; Resistance: 150R; Power Rating: 125mW; Temperature Coefficient: 100ppm/°C; Supplier 1: Digi-Key; Supplier Part Number 1: P150CCT-ND; Manufacturer Part Number: ERJ6ENF1500V; Stock 1: 287199; Pricing 1: 1 = 0.10000, 10 = 0.08100, 100 = 0.03110, 1000 = 0.01367, 2500 = 0.01181 (USD); RoHS: Yes; Mount: Surface Mount; Case/Package: 0805; Number of Pins: 2; Case Code (Metric): 2012; Case Code (Imperial): 0805; Contact Plating: Tin; Min Operating Temperature: -55°C; Max Operating Temperature: 155°C; Category: Resistors; Tolerance: 1%; Package Quantity: 1; Composition: Thick Film; Number of Terminations: 2; Military Standard: Not; Termination: SMD/SMT; Max Power Dissipation: 125mW; Voltage Rating (DC): 150V; Features: Automotive AEC-Q200; Working Voltage: 150V; Length: 2mm; Height: 0.6mm; Width: 0.049inch; Depth: 1.25mm; Radiation Hardening: No; REACH SVHC: No SVHC; Lead Free: Lead Free; ComponentLink1URL: https://datasheet.ciiva.com/11821/0900766b80f80784-11821520.pdf?src-supplier=RSComponents; ComponentLink1Description: https://datasheet.ciiva.com/11821/0900766b80f80784-11821520.pdf?src-supplier=RSComponents; ComponentLink2URL: https://datasheet.ciiva.com/7887/426256-7887029.pdf?src-supplier=Element14; ComponentLink2Description: https://datasheet.ciiva.com/7887/426256-7887029.pdf?src-supplier=Element14; ComponentLink3URL: https://datasheet.ciiva.com/16761/70260748-16761222.pdf?src-supplier=Allied+Electronics; ComponentLink3Description: https://datasheet.ciiva.com/16761/70260748-16761222.pdf?src-supplier=Allied+Electronics; ComponentLink4URL: https://datasheet.ciiva.com/46373/1678782-46373270.pdf?src-supplier=Element14; ComponentLink4Description: https://datasheet.ciiva.com/46373/1678782-46373270.pdf?src-supplier=Element14; ComponentLink5URL: https://datasheet.ciiva.com/46373/1678782-46373271.pdf?src-supplier=Element14; ComponentLink5Description: https://datasheet.ciiva.com/46373/1678782-46373271.pdf?src-supplier=Element14; ComponentLink6URL: https://datasheet.ciiva.com/30203/aoa0000ce2-30203641.pdf?src-supplier=Onlinecomponents.com; ComponentLink6Description: https://datasheet.ciiva.com/30203/aoa0000ce2-30203641.pdf?src-supplier=Onlinecomponents.com; ComponentLink7URL: https://datasheet.ciiva.com/9185/aoa0000ce2-9185514.pdf?src-supplier=Avnet; ComponentLink7Description: https://datasheet.ciiva.com/9185/aoa0000ce2-9185514.pdf?src-supplier=Avnet; Parameter 1: *
R5-R7 = ERJ6ENF2002V: RES SMD 20K OHM 1% 1/8W 0805; Manufacturer: Panasonic; Resistance: 20kR; Power Rating: 125mW; Voltage Rating: 150V; Temperature Coefficient: 100ppm/°C; Supplier 1: Digi-Key; Supplier Part Number 1: P20.0KCCT-ND; Manufacturer Part Number: ERJ6ENF2002V; Stock 1: 1039498; Pricing 1: 1 = 0.10000, 10 = 0.08100, 100 = 0.03110, 1000 = 0.01367, 2500 = 0.01181 (USD); RoHS: Yes; Mount: Surface Mount; Case/Package: 0805; Case Code (Metric): 2012; Case Code (Imperial): 0805; Contact Plating: Tin; Min Operating Temperature: -55°C; Max Operating Temperature: 155°C; Tolerance: 1%; Packaging: Tape and Reel; Package Quantity: 1; Composition: Thick Film; Number of Terminations: 2; Military Standard: Not; Termination: SMD/SMT; Max Power Dissipation: 125mW; Voltage Rating (DC): 150V; Features: Automotive AEC-Q200; Working Voltage: 150V; Length: 2mm; Height: 0.6mm; Width: 0.049inch; Depth: 1.25mm; Radiation Hardening: No; REACH SVHC: No SVHC; Lead Free: Lead Free; ComponentLink1URL: https://datasheet.ciiva.com/11821/0900766b80f80784-11821565.pdf?src-supplier=RSComponents; ComponentLink1Description: https://datasheet.ciiva.com/11821/0900766b80f80784-11821565.pdf?src-supplier=RSComponents; ComponentLink2URL: https://datasheet.ciiva.com/30072/aoa0000ce2-30072453.pdf?src-supplier=Onlinecomponents.com; ComponentLink2Description: https://datasheet.ciiva.com/30072/aoa0000ce2-30072453.pdf?src-supplier=Onlinecomponents.com; ComponentLink3URL: https://datasheet.ciiva.com/43460/426256-43460054.pdf?src-supplier=Farnell; ComponentLink3Description: https://datasheet.ciiva.com/43460/426256-43460054.pdf?src-supplier=Farnell; ComponentLink4URL: https://datasheet.ciiva.com/16786/70260748-16786968.pdf?src-supplier=Allied+Electronics; ComponentLink4Description: https://datasheet.ciiva.com/16786/70260748-16786968.pdf?src-supplier=Allied+Electronics; ComponentLink5URL: https://datasheet.ciiva.com/9192/aoa0000ce2-9192153.pdf?src-supplier=Avnet; ComponentLink5Description: https://datasheet.ciiva.com/9192/aoa0000ce2-9192153.pdf?src-supplier=Avnet; ComponentLink6URL: https://datasheet.ciiva.com/48531/aoa0000ce2-48531785.pdf?src-supplier=Avnet; ComponentLink6Description: https://datasheet.ciiva.com/48531/aoa0000ce2-48531785.pdf?src-supplier=Avnet; ComponentLink7URL: https://datasheet.ciiva.com/15159/getdatasheetpartid-249649-15159066.pdf?src-supplier=Verical; ComponentLink7Description: https://datasheet.ciiva.com/15159/getdatasheetpartid-249649-15159066.pdf?src-supplier=Verical; ComponentLink8URL: https://datasheet.ciiva.com/17211/aoa0000ce2-17211115.pdf?src-supplier=Avnet+Europe; ComponentLink8Description: https://datasheet.ciiva.com/17211/aoa0000ce2-17211115.pdf?src-supplier=Avnet+Europe; ComponentLink9URL: https://datasheet.ciiva.com/46389/426256-46389083.pdf?src-supplier=Element14; ComponentLink9Description: https://datasheet.ciiva.com/46389/426256-46389083.pdf?src-supplier=Element14; ComponentLink10URL: https://datasheet.ciiva.com/46377/426256-46377356.pdf?src-supplier=Element14; ComponentLink10Description: https://datasheet.ciiva.com/46377/426256-46377356.pdf?src-supplier=Element14; ComponentLink11URL: https://datasheet.ciiva.com/24025/aoa0000ce2-24025709.pdf?src-supplier=Mouser; ComponentLink11Description: https://datasheet.ciiva.com/24025/aoa0000ce2-24025709.pdf?src-supplier=Mouser; ComponentLink12URL: https://datasheet.ciiva.com/28688/1678782-28688637.pdf?src-supplier=Element14; ComponentLink12Description: https://datasheet.ciiva.com/28688/1678782-28688637.pdf?src-supplier=Element14; ComponentLink13URL: https://datasheet.ciiva.com/16512/aoa0000ce2-16512158.pdf?src-supplier=Avnet+Asia; ComponentLink13Description: https://datasheet.ciiva.com/16512/aoa0000ce2-16512158.pdf?src-supplier=Avnet+Asia; ComponentLink14URL: https://datasheet.ciiva.com/22749/1678782-22749662.pdf?src-supplier=Element14; ComponentLink14Description: https://datasheet.ciiva.com/22749/1678782-22749662.pdf?src-supplier=Element14; Category: Resistors